# Altium schematic sheet Sonda+wzmacniacz.SchDoc
size A4
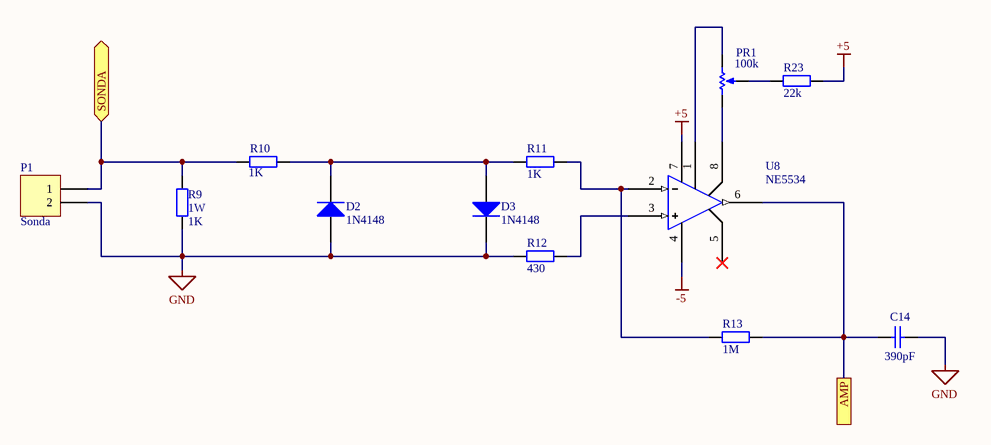
[diagram p0: Sonda+wzmacniacz.SchDoc]

## Parts
C14  value 390pF  [RAD-0.3]  (hidden comment: CL10B391KB8NNNC@TME)
D2  1N4148  [DIOD-SOD323-2-A_V]
D3  1N4148  [DIOD-SOD323-2-A_V]
P1  Sonda  [HDR1X2]
PR1  Resistance: 100k  [BOUR-3296W]  (hidden comment: T910Y-100K@TME)
R9  1W  value 1K  [AXIAL-0.4]
R10  value 1K  [AXIAL-0.4]  (hidden comment: 1206S4J0102T5E@TME)
R11  value 1K  [AXIAL-0.4]  (hidden comment: 1206S4J0102T5E@TME)
R12  value 430  [AXIAL-0.4]  (hidden comment: 1206S4J0102T5E@TME)
R13  value 1M  [AXIAL-0.4]  (hidden comment: 1206S4J0105T5E@TME)
R23  value 22k  [AXIAL-0.4]  (hidden comment: RC1206FR-0722KL@TME)
U8  NE5534

## Ports
AMP, SONDA (bidir)

## Nets
+5: R23.2 U8.7(VCC+)
-5: U8.4(VCC-)
GND: C14.1 D2.1(A) D3.2(K) P1.2 R9.1 R12.1
AMP: C14.2 R13.2 U8.6(OUT) ; port AMP
SONDA: P1.1 R9.2 R10.1 ; port SONDA
NetD2_2: D2.2(K) D3.1(A) R10.2 R11.1
NetPR1_1: PR1.1(CCW) U8.8(COMP/BAL)
NetPR1_2: PR1.2(S) R23.1
NetPR1_3: PR1.3(CW) U8.1(BALANCE)
NetR11_2: R11.2 R13.1 U8.2(IN-)
NetR12_2: R12.2 U8.3(IN+)

Not connected (* = marked no-connect by the designer): U8 5(COMP)*

## Library data of the parts
C14 = Cap: Capacitor; Published: 8-Jun-2000; LatestRevisionDate: 17-Jul-2002; LatestRevisionNote: Re-released for DXP Platform.; PackageReference: RAD-0.3; Publisher: Altium Limited; PackageDescription: Radial Cap, Thru-Hole; 2 Leads; 0.3 in Pin Spacing
D2 D3 = CMP-1667-00004-1: 1N4148WS-7-F / Fast Switching Diode, 75 V, 0.3 A, -65 to 150 degC, 2-Pin SOD323, RoHS, Tape and Reel; DatasheetVersion: Rev. 25-2, 03/2016; PackageDescription: 2-Pin Small Outline Diode, Body 1.7 x 1.3 mm; ComponentLink2Description: Datasheet; ComponentLink1URL: http://www.diodes.com/; PackageReference: SOD323-2; ComponentLink2URL: http://www.diodes.com/datasheets/ds30097.pdf; ComponentLink1Description: Manufacturer URL
P1 = Header 2: Header, 2-Pin; LatestRevisionDate: 17-Jul-2002; LatestRevisionNote: Re-released for DXP Platform.; Publisher: Altium Limited
PR1 = CMP-1747-00001-1: Square Trimpot(R) Trimming Potentiometer, 10 KOhm, +/- 10%, 0.5 W, -55 to 125 degC, 3-Pin THD, RoHS, Tube; Voltage Rating: 75 V; Tolerance: 1%; Power Rating: 100 mW; Case\Package: 0603; Type (Resistor): Thick Film; PackageDescription: 3-Pin Through Hole Device, Body 9.53 x 4.83 mm, Pitch 2.54 mm; RoHSCompliant: true; Package Quantity: 5000; Case Code (Metric): 1608; PackageReference: 3296W; ComponentLink2Description: Datasheet; REACH SVHC: Unknown; Case Code (Imperial): 0603; ComponentLink1URL: http://www.bourns.com/; Width: 0.85 mm; Radiation Hardening: No; Min Operating Temperature: -55 degC; Mount: Surface Mount; ComponentLink1Description: Manufacturer URL; Max Operating Temperature: 155 degC; Weight: 7.1E-05 oz; Pins: 2; DatasheetVersion: May-16; Packaging: Tape and Reel; Height: 0.45 mm; Length: 1.55 mm; ComponentLink2URL: http://www.bourns.com/docs/Product-Datasheets/3296.pdf
R9 = Res2: Resistor / HP06W2J0102T5E; Published: 8-Jun-2000; LatestRevisionDate: 17-Jul-2002; LatestRevisionNote: Re-released for DXP Platform.; PackageReference: AXIAL-0.4; Publisher: Altium Limited; PackageDescription: Axial Device, Thru-Hole; 2 Leads; 0.4 in Pin Spacing
R10-R13 R23 = Res2: Resistor; Published: 8-Jun-2000; LatestRevisionDate: 17-Jul-2002; LatestRevisionNote: Re-released for DXP Platform.; PackageReference: AXIAL-0.4; Publisher: Altium Limited; PackageDescription: Axial Device, Thru-Hole; 2 Leads; 0.4 in Pin Spacing